# Altium schematic sheet slave.SchDoc
size A4
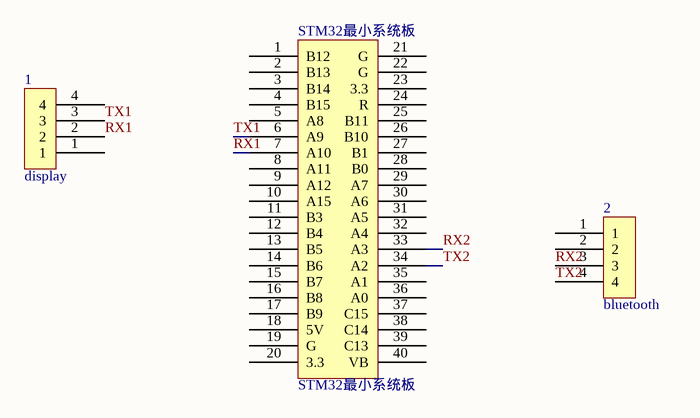
[diagram p0: slave.SchDoc]

## Parts
1  display  [con4]
2  bluetooth  [con4]
STM32最小系统板  STM32最小系统板  [STM32最小系统板]

## Nets
RX1: 1.2 STM32最小系统板.7(A10)
RX2: 2.3 STM32最小系统板.33(A3)
TX1: 1.3 STM32最小系统板.6(A9)
TX2: 2.4 STM32最小系统板.34(A2)

Not connected (* = marked no-connect by the designer): 1 1 4; 2 1 2; STM32最小系统板 1(B12) 2(B13) 3(B14) 4(B15) 5(A8) 8(A11) 9(A12) 10(A15) 11(B3) 12(B4) 13(B5) 14(B6) 15(B7) 16(B8) 17(B9) 18(5V) 19(G) 20(3.3) 21(G) 22(G) 23(3.3) 24(R) 25(B11) 26(B10) 27(B1) 28(B0) 29(A7) 30(A6) 31(A5) 32(A4) 35(A1) 36(A0) 37(C15) 38(C14) 39(C13) 40(VB)

## Library data of the parts
1 2 = Component_1